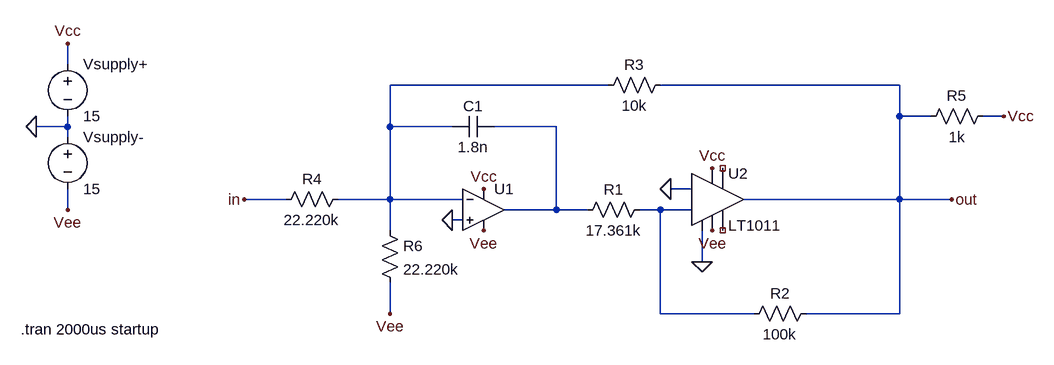
[diagram p0: schematic sigma-delta.asc]
sigma-delta.asc, the LTspice schematic file:
Version 4
SHEET 1 1544 680
WIRE -48 64 -48 32
WIRE 784 96 448 96
WIRE 1232 96 864 96
WIRE 1232 144 1232 96
WIRE 1280 144 1232 144
WIRE 1392 144 1360 144
WIRE -48 160 -48 144
WIRE -48 160 -96 160
WIRE 448 160 448 96
WIRE 544 160 448 160
WIRE 704 160 608 160
WIRE -48 176 -48 160
WIRE 912 256 880 256
WIRE 288 272 224 272
WIRE 448 272 448 160
WIRE 448 272 368 272
WIRE 560 272 448 272
WIRE 1232 272 1232 144
WIRE 1232 272 992 272
WIRE 1312 272 1232 272
WIRE -48 288 -48 256
WIRE 704 288 704 160
WIRE 704 288 624 288
WIRE 752 288 704 288
WIRE 864 288 832 288
WIRE 912 288 864 288
WIRE 560 304 544 304
WIRE 448 320 448 272
WIRE 928 368 928 320
WIRE 448 448 448 400
WIRE 864 448 864 288
WIRE 1008 448 864 448
WIRE 1232 448 1232 272
WIRE 1232 448 1088 448
FLAG -96 160 0
FLAG -48 32 Vcc
FLAG -48 288 Vee
FLAG 544 304 0
FLAG 880 256 0
FLAG 592 256 Vcc
FLAG 592 320 Vee
FLAG 944 224 Vcc
FLAG 944 320 Vee
FLAG 928 368 0
FLAG 1392 144 Vcc
FLAG 1312 272 out
FLAG 448 448 Vee
FLAG 224 272 in
SYMBOL voltage -48 48 R0
WINDOW 123 0 0 Left 2
WINDOW 39 0 0 Left 2
SYMATTR InstName Vsupply+
SYMATTR Value 15
SYMBOL voltage -48 160 R0
WINDOW 123 0 0 Left 2
WINDOW 39 0 0 Left 2
SYMATTR InstName Vsupply-
SYMATTR Value 15
SYMBOL res 272 288 R270
WINDOW 0 32 56 VTop 2
WINDOW 3 0 56 VBottom 2
SYMATTR InstName R4
SYMATTR Value 22.220k
SYMBOL res 432 304 R0
SYMATTR InstName R6
SYMATTR Value 22.220k
SYMBOL cap 544 176 R270
WINDOW 0 32 32 VTop 2
WINDOW 3 0 32 VBottom 2
SYMATTR InstName C1
SYMATTR Value 1.8n
SYMBOL res 736 304 R270
WINDOW 0 32 56 VTop 2
WINDOW 3 0 56 VBottom 2
SYMATTR InstName R1
SYMATTR Value 17.361k
SYMBOL Comparators\\LT1011 944 272 R0
SYMATTR InstName U2
SYMBOL res 1104 432 R90
WINDOW 0 0 56 VBottom 2
WINDOW 3 32 56 VTop 2
SYMATTR InstName R2
SYMATTR Value 100k
SYMBOL res 768 112 R270
WINDOW 0 32 56 VTop 2
WINDOW 3 0 56 VBottom 2
SYMATTR InstName R3
SYMATTR Value 10k
SYMBOL res 1264 160 R270
WINDOW 0 32 56 VTop 2
WINDOW 3 0 56 VBottom 2
SYMATTR InstName R5
SYMATTR Value 1k
SYMBOL Opamps\\UniversalOpamp2 592 288 R0
SYMATTR InstName U1
TEXT -120 472 Left 2 !.tran 2000us startup

The netlist it stands for:
* sigma-delta.asc
Vsupply+ Vcc 0 15
Vsupply- 0 Vee 15
R4 in N001 22.220k
R6 N001 Vee 22.220k
C1 N001 N002 1.8n
R1 N002 N003 17.361k
XU2 0 N003 0 Vee NC_01 NC_02 out Vcc LT1011
R2 out N003 100k
R3 N001 out 10k
R5 out Vcc 1k
XU1 0 N001 Vcc Vee N002 level.2 Avol=1Meg GBW=10Meg Slew=10Meg ilimit=25m rail=0 Vos=0 phimargin=45 en=0 enk=0 in=0 ink=0 Rin=500Meg  ; pins IN+ IN- V+ V- OUT
.tran 2000us startup
.lib LTC1.lib
.lib UniversalOpamps2.sub
.backanno
.end